# EAGLE design czuj_ruchu_naj (EAGLE 6.6.0)
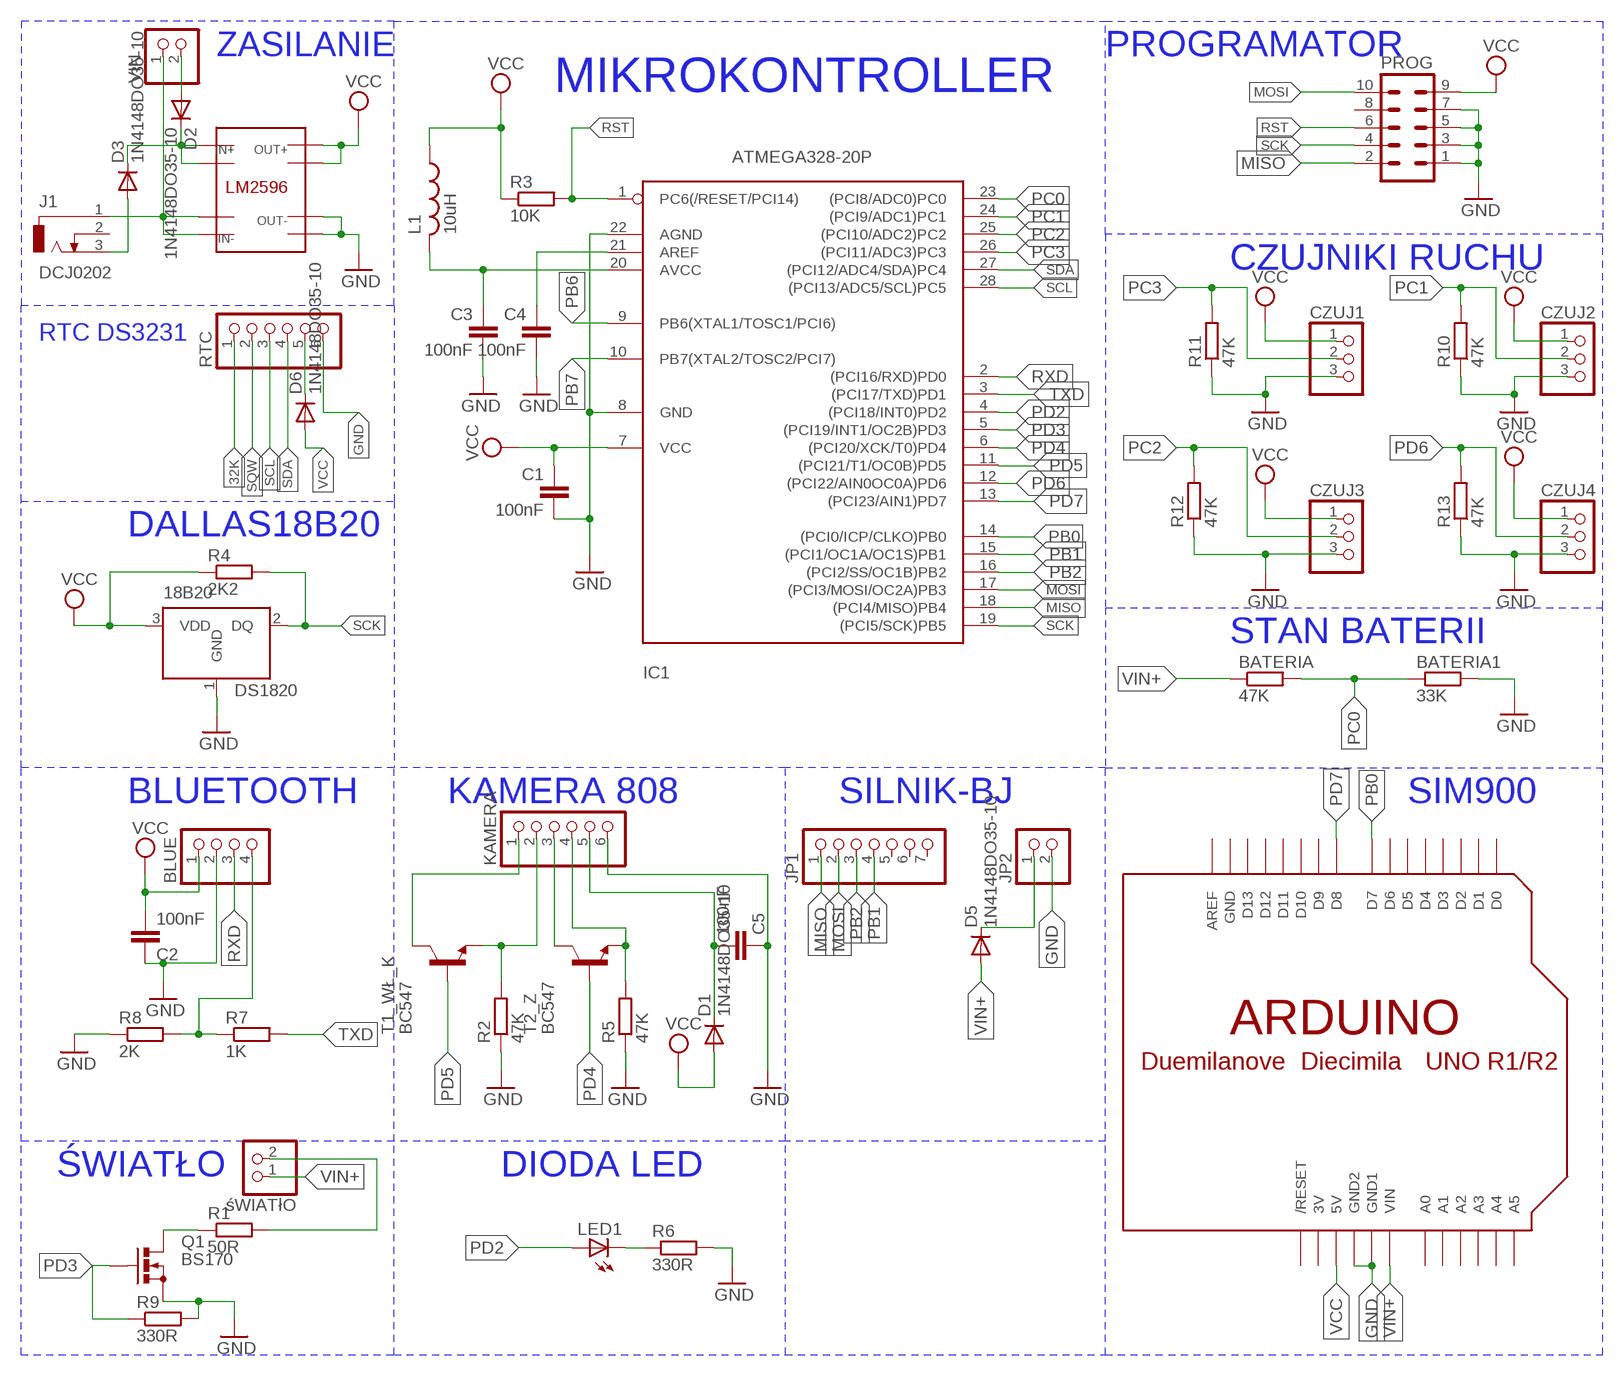
[diagram p0: schematic, sheet 1]

## Parts
18B20  DS1820  [TO-92]
BATERIA  47K  R-EU_0204/7  [0204/7]
BATERIA1  33K  R-EU_0204/7  [0204/7]
BLUE  PINHD-1X4  [1X04]
C1  100nF  C2,5-3  [C2.5-3]
C2  100nF  C2,5-3  [C2.5-3]
C3  100nF  C2,5-3  [C2.5-3]
C4  100nF  C2,5-3  [C2.5-3]
C5  100nF  C2,5-3  [C2.5-3]
CZUJ1  PINHD-1X3  [1X03]
CZUJ2  PINHD-1X3  [1X03]
CZUJ3  PINHD-1X3  [1X03]
CZUJ4  PINHD-1X3  [1X03]
D1  1N4148DO35-10  [DO35-10]
D2  1N4148DO35-10  [DO35-10]
D3  1N4148DO35-10  [DO35-10]
D5  1N4148DO35-10  [DO35-10]
D6  1N4148DO35-10  [DO35-10]
IC1  ATMEGA328-20P  [DIL28-3]
J1  DCJ0202  [DCJ0202]
JP1  PINHD-1X7/90  [1X07/90]
JP2  PINHD-1X2/90  [1X02/90]
KAMERA  PINHD-1X6/90  [1X06/90]
L1  10uH  L-US6000-XXX-RC  [6000-XXXX-RC]
LED1  LED5MM  [LED5MM]
PROG  MA05-2  [MA05-2]
Q1  BS170  [SOT54E]
R1  50R  R-EU_0204/7  [0204/7]
R2  47K  R-EU_0204/7  [0204/7]
R3  10K  R-EU_0204/7  [0204/7]
R4  2K2  R-EU_0204/7  [0204/7]
R5  47K  R-EU_0204/7  [0204/7]
R6  330R  R-EU_0204/7  [0204/7]
R7  1K  R-EU_0204/7  [0204/7]
R8  2K  R-EU_0204/7  [0204/7]
R9  330R  R-EU_0204/7  [0204/7]
R10  47K  R-EU_0204/7  [0204/7]
R11  47K  R-EU_0204/7  [0204/7]
R12  47K  R-EU_0204/7  [0204/7]
R13  47K  R-EU_0204/7  [0204/7]
RTC  PINHD-1X6/90  [1X06/90]
T1_WŁ_K  BC547  [TO92]
T2_Z  BC547  [TO92]
U$1  ARDUINO-NOHOLE  [ARDUINO-NOHOLE]
VIN  PINHD-1X2  [1X02]
ZASILANIE  LM2596  [LM25]
śWIATłO  PINHD-1X2  [1X02]

## Nets
32K: RTC.1
GND: 18B20.1(GND) BATERIA1.2 BLUE.2 C1.2 C2.1 C3.2 C4.2 C5.1 CZUJ1.3 CZUJ2.3 CZUJ3.3 CZUJ4.3 IC1.8(GND) IC1.22(AGND) JP2.2 KAMERA.6 PROG.1 PROG.3 PROG.5 PROG.7 Q1.S R2.1 R5.1 R6.2 R8.1 R9.2 R10.1 R11.1 R12.1 R13.1 RTC.6 U$1.GND1 U$1.GND2 ZASILANIE.OUT- ZASILANIE.OUT-.(OUT_)
MISO: IC1.18((PCI4/MISO)PB4) JP1.1 PROG.2
MOSI: IC1.17((PCI3/MOSI/OC2A)PB3) JP1.2 PROG.10
N$1: Q1.D R1.1
N$2: D2.A VIN.2
N$3: KAMERA.1 T1_WŁ_K.3(C)
N$4: R1.2 śWIATłO.2
N$5: C3.1 IC1.20(AVCC) L1.2
N$6: C4.1 IC1.21(AREF)
N$7: KAMERA.3 T2_Z.3(C)
N$8: C5.2 D1.C KAMERA.5
N$9: D3.A J1.3
N$10: LED1.K(C) R6.1
N$12: KAMERA.2 R2.2 T1_WŁ_K.1(E)
N$13: KAMERA.4 R5.2 T2_Z.1(E)
N$15: D6.C RTC.5
PB0: IC1.14((PCI0/ICP/CLKO)PB0) U$1.D7
PB1: IC1.15((PCI1/OC1A/OC1S)PB1) JP1.4
PB2: IC1.16((PCI2/SS/OC1B)PB2) JP1.3
PB6: IC1.9(PB6(XTAL1/TOSC1/PCI6))
PB7: IC1.10(PB7(XTAL2/TOSC2/PCI7))
PC0: BATERIA1.1 BATERIA.2 IC1.23((PCI8/ADC0)PC0)
PC1: CZUJ2.2 IC1.24((PCI9/ADC1)PC1) R10.2
PC2: CZUJ3.2 IC1.25((PCI10/ADC2)PC2) R12.2
PC3: CZUJ1.2 IC1.26((PCI11/ADC3)PC3) R11.2
PD2: IC1.4((PCI18/INT0)PD2) LED1.A
PD3: IC1.5((PCI19/INT1/OC2B)PD3) Q1.G R9.1
PD4: IC1.6((PCI20/XCK/T0)PD4) T2_Z.2(B)
PD5: IC1.11((PCI21/T1/OC0B)PD5) T1_WŁ_K.2(B)
PD6: CZUJ4.2 IC1.12((PCI22/AIN0OC0A)PD6) R13.2
PD7: IC1.13((PCI23/AIN1)PD7) U$1.D8
RST: IC1.1(PC6(/RESET/PCI14)) PROG.6 R3.2
RXD: BLUE.3 IC1.2((PCI16/RXD)PD0)
SCK: 18B20.2(DQ) IC1.19((PCI5/SCK)PB5) PROG.4 R4.2
SCL: IC1.28((PCI13/ADC5/SCL)PC5) RTC.3
SDA: IC1.27((PCI12/ADC4/SDA)PC4) RTC.4
SQW: RTC.2
TXD: IC1.3((PCI17/TXD)PD1) R7.2
TXDB: BLUE.4 R7.1 R8.2
VCC: 18B20.3(VDD) BLUE.1 C1.1 C2.2 CZUJ1.1 CZUJ2.1 CZUJ3.1 CZUJ4.1 D1.A D6.A IC1.7(VCC) L1.1 PROG.9 R3.1 R4.1 U$1.5V ZASILANIE.OUT+ ZASILANIE.OUT+.
VCCS1: D5.C JP2.1
VIN+: BATERIA.1 D2.C D3.C D5.A U$1.VIN ZASILANIE.IN+ ZASILANIE.IN+. śWIATłO.1
VIN-: J1.1 VIN.1 ZASILANIE.IN- ZASILANIE.IN-.
Unconnected: J1.2 JP1.5 JP1.6 JP1.7 PROG.8 U$1.A0 U$1.A1 U$1.A2 U$1.A3 U$1.A4 U$1.A5 U$1.AREF U$1.D0 U$1.D1 U$1.D2 U$1.D3 U$1.D4 U$1.D5 U$1.D6 U$1.D9 U$1.D10 U$1.D11 U$1.D12 U$1.D13 U$1.RESET(/RESET)

## Notes on the sheet
- ZASILANIE | PROGRAMATOR
- MIKROKONTROLLER
- CZUJNIKI RUCHU
- RTC DS3231
- DALLAS18B20
- STAN BATERII
- BLUETOOTH | KAMERA 808 | SILNIK-BJ | SIM900
- ŚWIATŁO | DIODA LED

## Power pins joined to a net without a drawn wire
3V: U$1.3V
GND: U$1.GND

## Library data of the parts
18B20 = DS1820:DS1820: DS1820 - 1-Wire Digital Thermometer
BATERIA BATERIA1 R1-R13 = resistor:R-EU_: RESISTOR, European symbol
BLUE = pinhead:PINHD-1X4: PIN HEADER
C1-C5 = capacitor-wima:C: CAPACITOR naming: grid - package width
CZUJ1-CZUJ4 = pinhead:PINHD-1X3: PIN HEADER
D1-D3 D5 D6 = diode:1N4148: DIODE high speed (Philips)
IC1 = atmega328:ATMEGA328*P: MICROCONTROLLER 32 kBytes FLASH 2 kBytes SRAM 1 kBytes EEPROM USART 8-channel 10 bit ADC
J1 = con-jack:DCJ0202: DC POWER JACK Source: DCJ0202.pdf; OC_FARNELL: unknown; OC_NEWARK: unknown
JP1 = pinhead:PINHD-1X7: PIN HEADER
JP2 VIN śWIATłO = pinhead:PINHD-1X2: PIN HEADER
KAMERA RTC = pinhead:PINHD-1X6: PIN HEADER
L1 = rcl:L-US: INDUCTOR, American symbol
LED1 = led:LED: LED OSRAM: - CHIPLED LG R971, LG N971, LY N971, LG Q971, LY Q971, LO R971, LY R971 LH N974, LH R974 LS Q976, LO Q976, LY Q976 LO Q996 - Hyper CHIPLED LW Q18S LB Q993, LB Q99A, LB R99A - SideLED LS A670, LO A670, LY A670, LG A670, LP A670 LB A673, LV A673, LT A673, LW A673 LH A674 LY A675 LS A676, LA A676, LO A676, LY A676, LW A676 LS A679, LY A679, LG A679 - Hyper Micro SIDELED® LS Y876, LA Y876, LO Y876, LY Y876 LT Y87S - SmartLED LW L88C, LW L88S LB L89C, LB L89S, LG L890 LS L89K, LO L89K, LY L89K LS L896, LA L896, LO L896, LY L896 - TOPLED LS T670, LO T670, LY T670, LG T670, LP T670 LSG T670, LSP T670, LSY T670, LOP T670, LYG T670 LG T671, LOG T671, LSG T671 LB T673, LV T673, LT T673, LW T673 LH T674 LS T676, LA T676, LO T676, LY T676, LB T676, LH T676, LSB T676, LW T676 LB T67C, LV T67C, LT T67C, LS T67K, LO T67K, LY T67K, LW E67C LS E67B, LA E67B, LO E67B, LY E67B, LB E67C, LV E67C, LT E67C LW T67C LS T679, LY T679, LG T679 LS T770, LO T770, LY T770, LG T770, LP T770 LB T773, LV T773, LT T773, LW T773 LH T774 LS E675, LA E675, LY E675, LS T675 LS T776, LA T776, LO T776, LY T776, LB T776 LHGB T686 LT T68C, LB T68C - Hyper Mini TOPLED® LB M676 - Mini TOPLED Santana® LG M470 LS M47K, LO M47K, LY M47K Source: http://www.osram.convergy.de LUXEON: - LUMILED® LXK2-PW12-R00, LXK2-PW12-S00, LXK2-PW14-U00, LXK2-PW14-V00 LXK2-PM12-R00, LXK2-PM12-S00, LXK2-PM14-U00 LXK2-PE12-Q00, LXK2-PE12-R00, LXK2-PE12-S00, LXK2-PE14-T00, LXK2-PE14-U00 LXK2-PB12-K00, LXK2-PB12-L00, LXK2-PB12-M00, LXK2-PB14-N00, LXK2-PB14-P00, LXK2-PB14-Q00 LXK2-PR12-L00, LXK2-PR12-M00, LXK2-PR14-Q00, LXK2-PR14-R00 LXK2-PD12-Q00, LXK2-PD12-R00, LXK2-PD12-S00 LXK2-PH12-R00, LXK2-PH12-S00 LXK2-PL12-P00, LXK2-PL12-Q00, LXK2-PL12-R00 Source: www.luxeon.com KINGBRIGHT: KA-3528ASYC Source: www.kingbright.com
PROG = con-lstb:MA05-2: PIN HEADER; OC_FARNELL: unknown; OC_NEWARK: unknown
Q1 = transistor-small-signal:BS170: N-CHANNEL MOS FET
T1_WŁ_K T2_Z = transistor:BC547: NPN TRANSISTOR
U$1 = adafruit:ARDUINO: Arduino Diecimila/Duemilanove Make a shield with ease, this package has all the named pins as well as the two mounting drill holes and an outline of the USB and DC power connector. The outline is on the DIMENSION layer, so if your board house uses it they will cut the outline to match. http://www.ladyada.net/library/pcb/eaglelibrary.html
ZASILANIE = lm2596s:LM2596

## Board
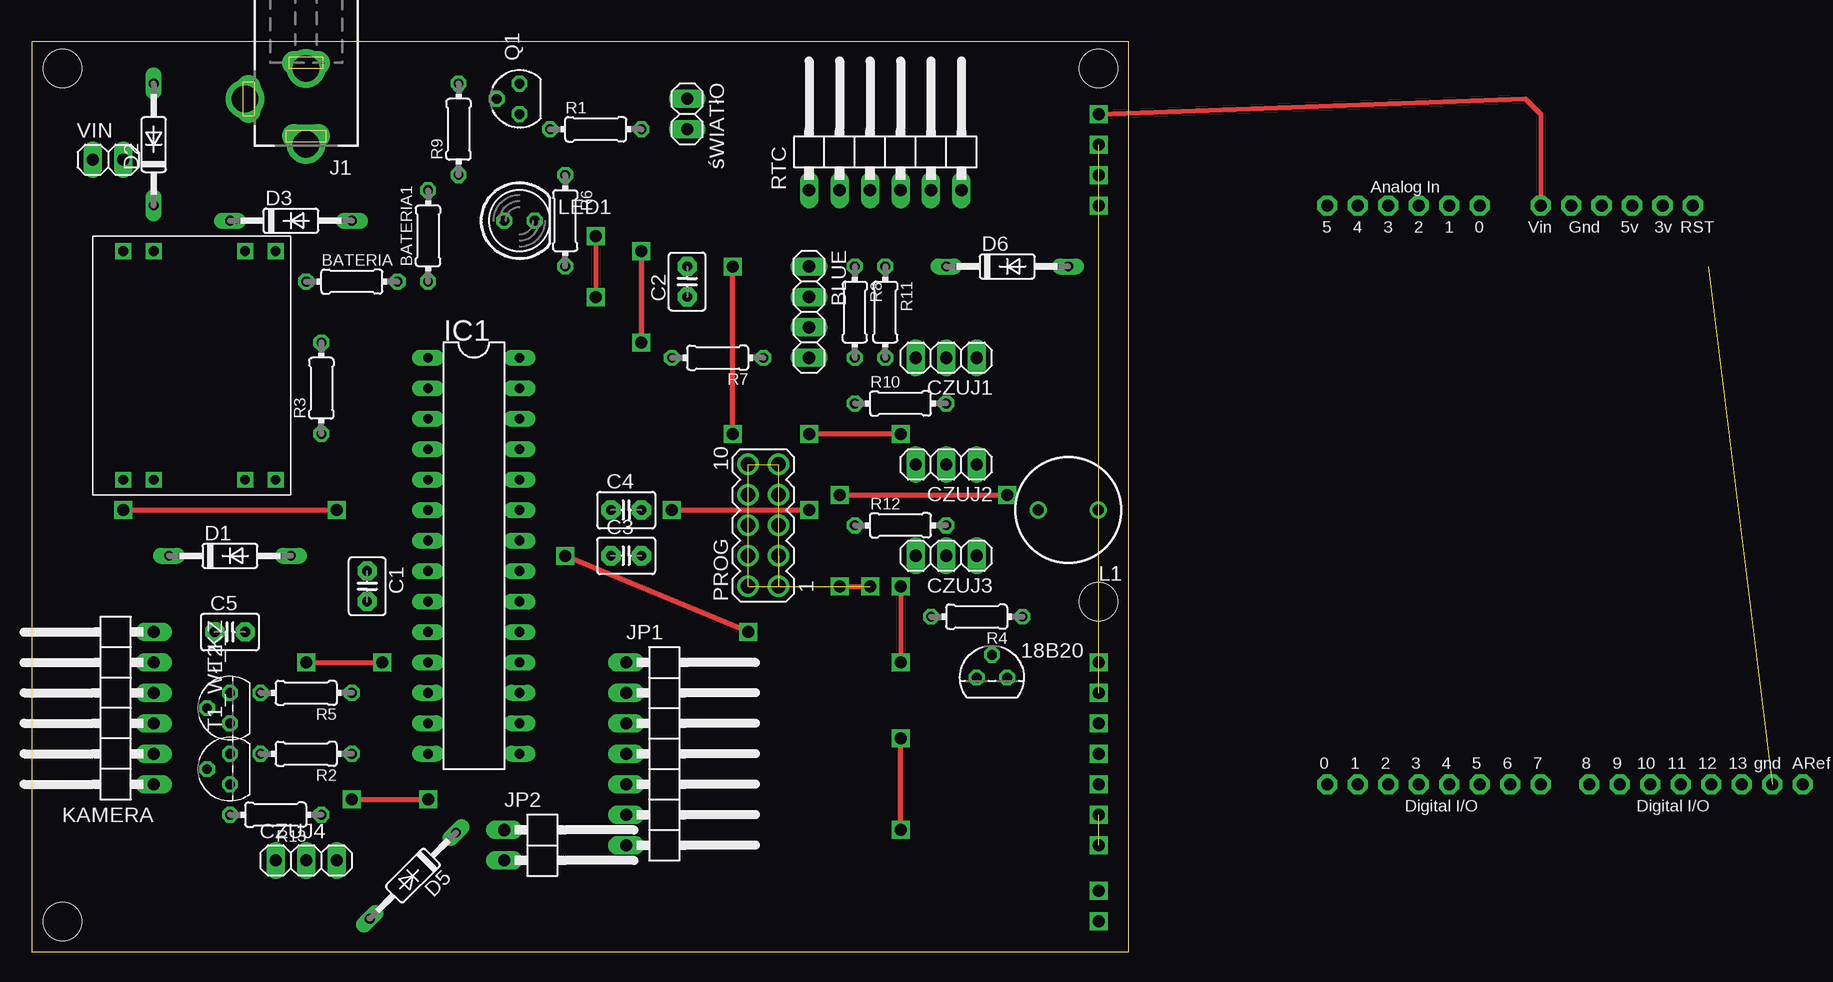
[diagram p1: board, top side]
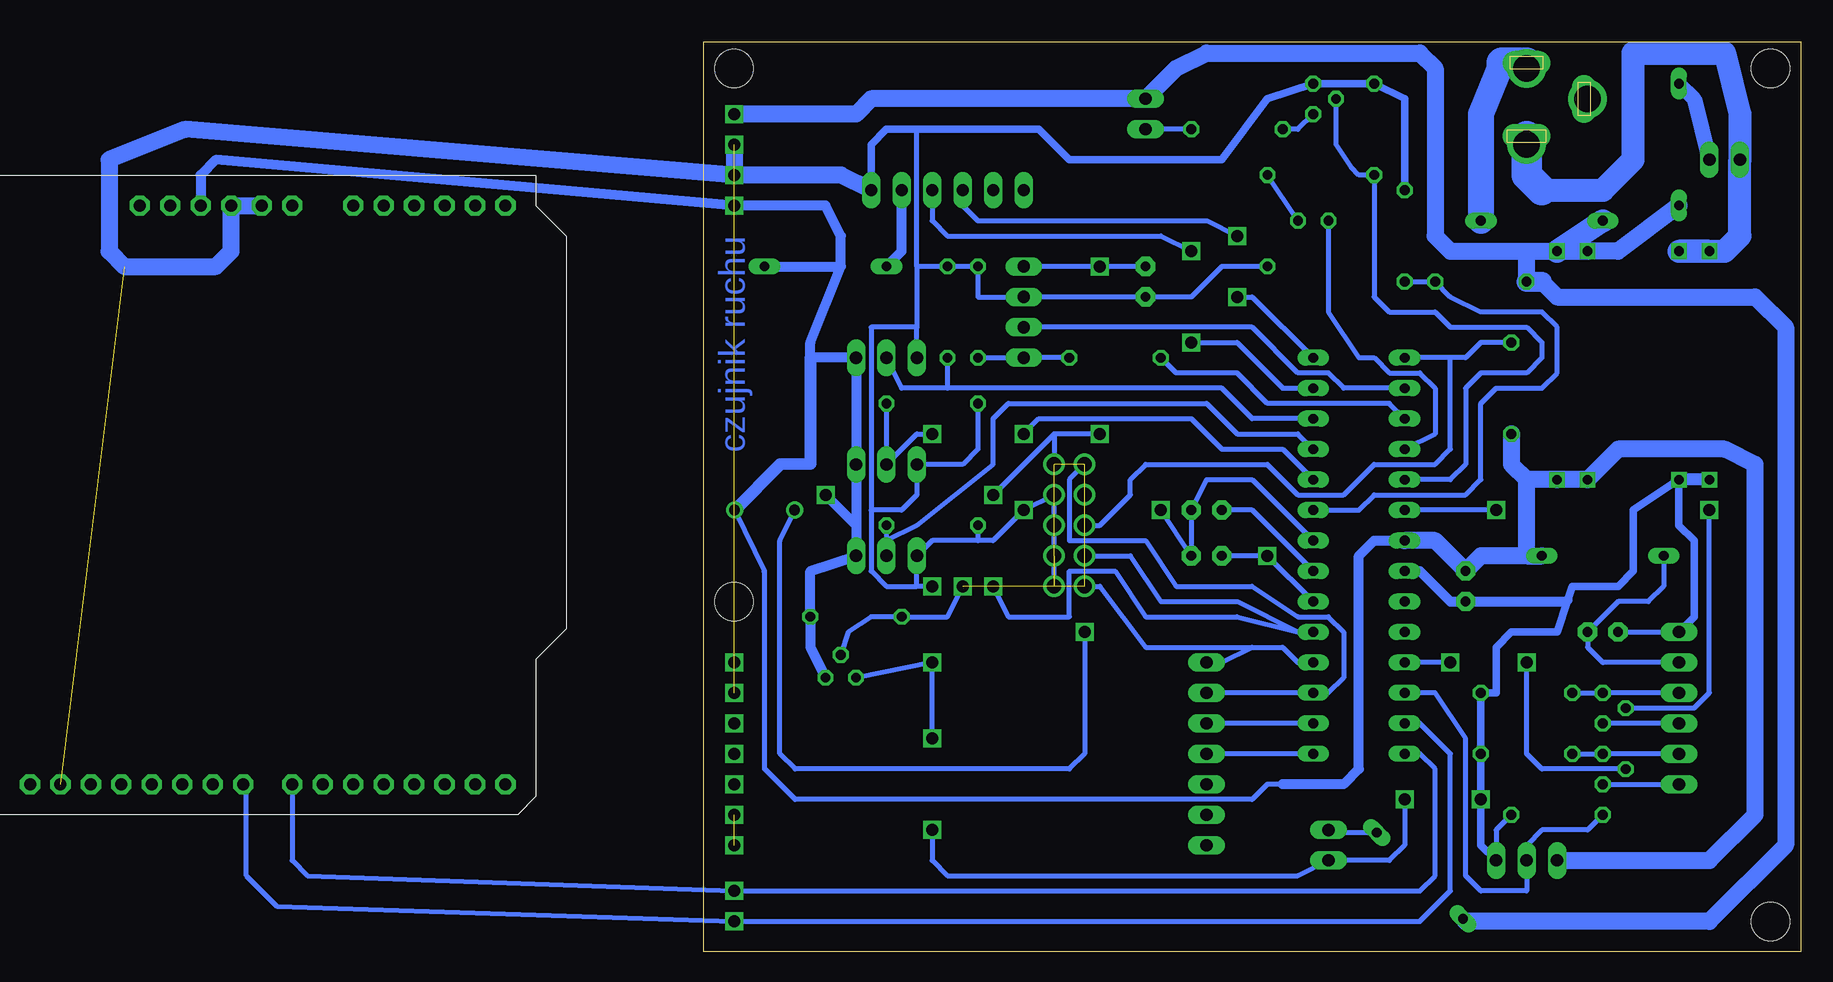
[diagram p2: board, bottom side, seen from below]

Size 91.42 x 75.87 mm. Coordinates in mm from the lower left corner, seen from the top.
Outline: 0,0 91.42,0 91.42,75.87 0,75.87 0,0
Copper layers (1*16): Top 0.035mm / dielectric 1.5mm / Bottom 0.035mm
Design rules "default": minimum track width 10mil, minimum drill 24mil, track to track 8mil, track to pad 8mil, pad to pad 8mil, via to via 8mil, smd to smd 8mil, copper to edge 40mil, drill to drill 8mil, minimum pad ring 10mil, minimum via ring 8mil, stop-mask expansion 4mil, vias tented up to drill 0mil, thermal gap 10mil
Holes 3.2 mm at 153.67,72.39 152.4,7.62 2.54,73.66 2.54,2.54 88.9,73.66 88.9,29.21

### Footprints (pad centres in the part's own frame; a part is rotated, then mirrored left to right if it is on the bottom)
TO-92 = drill 0.813 pad 1.27 octagon: 1 -1.27,0; 2 0,1.905; 3 1.27,0
0204/7 = drill 0.813 octagon: 1 -3.81,0; 2 3.81,0
1X04 = drill 1.016 long: 1 -3.81,0; 2 -1.27,0; 3 1.27,0; 4 3.81,0
C2.5-3 = drill 0.813 pad 1.6 octagon: 1 -1.27,0; 2 1.27,0
1X03 = drill 1.016 long: 1 -2.54,0; 2 0,0; 3 2.54,0
DO35-10 = drill 0.813 long: A 5.08,0; C -5.08,0
DIL28-3 = drill 0.813 long: 1 -16.51,-3.81; 2 -13.97,-3.81; 3 -11.43,-3.81; 4 -8.89,-3.81; 5 -6.35,-3.81; 6 -3.81,-3.81; 7 -1.27,-3.81; 8 1.27,-3.81; 9 3.81,-3.81; 10 6.35,-3.81; 11 8.89,-3.81; 12 11.43,-3.81; 13 13.97,-3.81; 14 16.51,-3.81; 15 16.51,3.81; 16 13.97,3.81; 17 11.43,3.81; 18 8.89,3.81; 19 6.35,3.81; 20 3.81,3.81; 21 1.27,3.81; 22 -1.27,3.81; 23 -3.81,3.81; 24 -6.35,3.81; 25 -8.89,3.81; 26 -11.43,3.81; 27 -13.97,3.81; 28 -16.51,3.81
DCJ0202 = drill 1 pad 2 long: 1 0,3.1; 2 4.8,0; 3 0,-3
1X07/90 = drill 1.016 long: 1 -7.62,-3.81; 2 -5.08,-3.81; 3 -2.54,-3.81; 4 0,-3.81; 5 2.54,-3.81; 6 5.08,-3.81; 7 7.62,-3.81
1X02/90 = drill 1.016 long: 1 -1.27,-3.81; 2 1.27,-3.81
1X06/90 = drill 1.016 long: 1 -6.35,-3.81; 2 -3.81,-3.81; 3 -1.27,-3.81; 4 1.27,-3.81; 5 3.81,-3.81; 6 6.35,-3.81
6000-XXXX-RC = drill 0.9 pad 1.422: 1 -2.5,0; 2 2.5,0
LED5MM = drill 0.813 octagon: A -1.27,0; K 1.27,0
MA05-2 = drill 1.016 octagon: 1 -5.08,-1.27; 2 -5.08,1.27; 3 -2.54,-1.27; 4 -2.54,1.27; 5 0,-1.27; 6 0,1.27; 7 2.54,-1.27; 8 2.54,1.27; 9 5.08,-1.27; 10 5.08,1.27
SOT54E = drill 0.813 octagon: D -1.27,0; G 0,1.905; S 1.27,0
TO92 = drill 0.813 octagon: 1 1.27,0; 2 0,1.905; 3 -1.27,0
ARDUINO-NOHOLE = drill 1 pad 1.676 octagon: 3V 35.56,2.54; 5V 38.1,2.54; A0 50.8,2.54; A1 53.34,2.54; A2 55.88,2.54; A3 58.42,2.54; A4 60.96,2.54; A5 63.5,2.54; AREF 23.876,50.8; D0 63.5,50.8; D1 60.96,50.8; D2 58.42,50.8; D3 55.88,50.8; D4 53.34,50.8; D5 50.8,50.8; D6 48.26,50.8; D7 45.72,50.8; D8 41.656,50.8; D9 39.116,50.8; D10 36.576,50.8; D11 34.036,50.8; D12 31.496,50.8; D13 28.956,50.8; GND 26.416,50.8; GND1 43.18,2.54; GND2 40.64,2.54; RESET 33.02,2.54; VIN 45.72,2.54
1X02 = drill 1.016 long: 1 -1.27,0; 2 1.27,0
LM25 = drill 0.8 square: IN+ 0,2.54; IN+. 0,0; IN- 0,12.7; IN-. 0,10.16; OUT+ -19.05,2.54; OUT+. -19.05,0; OUT- -19.05,12.7; OUT-. -19.05,10.16

### Placement (x,y rotation side)
18B20  80.01,22.86 0 top
BATERIA  26.67,55.88 0 top
BATERIA1  33.02,59.69 90 top
BLUE  64.77,53.34 270 top
C1  27.94,30.48 270 top
C2  54.61,55.88 90 top
C3  49.53,33.02 0 top
C4  49.53,36.83 0 top
C5  16.51,26.67 0 top
CZUJ1  76.2,49.53 180 top
CZUJ2  76.2,40.64 180 top
CZUJ3  76.2,33.02 180 top
CZUJ4  22.86,7.62 0 top
D1  16.51,33.02 0 top
D2  10.16,67.31 90 top
D3  21.59,60.96 0 top
D5  31.75,6.35 225 top
D6  81.28,57.15 0 top
IC1  36.83,33.02 270 top
J1  22.86,71.12 180 top
JP1  53.34,16.51 270 top
JP2  43.18,8.89 270 top
KAMERA  6.35,20.32 90 top
L1  86.36,36.83 180 top
LED1  40.64,60.96 0 top
PROG  60.96,35.56 90 top
Q1  40.64,71.12 90 top
R1  46.99,68.58 0 top
R2  22.86,16.51 180 top
R3  24.13,46.99 90 top
R4  78.74,27.94 180 top
R5  22.86,21.59 180 top
R6  44.45,60.96 270 top
R7  57.15,49.53 180 top
R8  68.58,53.34 270 top
R9  35.56,68.58 90 top
R10  72.39,45.72 0 top
R11  71.12,53.34 270 top
R12  72.39,35.56 0 top
R13  20.32,11.43 180 top
RTC  71.12,67.31 0 top
T1_WŁ_K  16.51,15.24 90 top
T2_Z  16.51,20.32 90 top
U$1  171.45,64.77 180 top  (outside the outline)
VIN  6.35,66.04 0 top
ZASILANIE  20.32,58.42 90 top
śWIATłO  54.61,69.85 270 top

### Tracks (layer width: path | path; a pad name or v marks a point on that pad's centre or on a via)
GND  (via drill 1)  (3 unrouted)
  Top 0.406: v26.67,12.7 v33.02,12.7 | v72.39,10.16 v72.39,17.78 | v53.34,36.83 v64.77,36.83 | v72.39,30.48 v72.39,24.13
  Bottom 0.406: PROG.1 PROG.7 v64.77,36.83 67.31,34.29 68.58,34.29 | IC1.22 45.72,39.37 49.53,39.37 C4.2 C3.2 v53.34,36.83 | v33.02,12.7 33.02,8.89 34.29,7.62 JP2.2 41.91,6.35 71.12,6.35 72.39,7.62 v72.39,10.16 | 73.66,57.15 73.66,68.58 | 73.66,57.15 R11.1 R8.1 68.58,54.61 BLUE.2 C2.1 50.8,54.61 48.26,57.15 R6.2 | 73.66,57.15 73.66,52.07 | CZUJ1.3 73.66,52.07 | 73.66,52.07 77.47,52.07 77.47,36.83 | 77.47,36.83 77.47,31.75 76.2,30.48 73.66,30.48 | v72.39,30.48 73.66,30.48 | 73.66,30.48 CZUJ3.3 72.39,34.29 68.58,34.29 | 77.47,36.83 74.93,36.83 73.66,38.1 CZUJ2.3 69.85,40.64 68.58,41.91 R10.1 | v72.39,17.78 v72.39,24.13 18B20.1 | C5.1 KAMERA.6 | R13.1 25.4,10.16 CZUJ4.3 | R12.1 68.58,34.29
  Bottom 0.61: 8.89,39.37 ZASILANIE.OUT-. | ZASILANIE.OUT-. 10.16,35.56 8.89,34.29 8.89,27.94 KAMERA.6 | RTC.6 77.47,67.31 76.2,68.58 73.66,68.58 63.5,68.58 60.96,66.04 48.26,66.04 44.45,71.12 Q1.S R9.2 33.02,71.12 BATERIA1.2 | ZASILANIE.OUT-. 13.97,36.83 13.97,31.75 15.24,30.48 19.05,30.48 19.43,29.34 20.32,26.67 24.13,26.67 25.4,25.4 25.4,21.59 R5.1 R2.1 v26.67,12.7 26.67,8.89 CZUJ4.3 | C1.2 29.21,29.21
  Bottom 0.813: 19.43,29.34 19.56,29.21 29.21,29.21 31.75,31.75 IC1.8
  Bottom 1.016: ZASILANIE.OUT- ZASILANIE.OUT-.
  Bottom 1.422: U$1.GND1 U$1.GND2 130.81,58.42 132.08,57.15 139.7,57.15 140.97,58.42 140.97,66.04 134.62,68.58 v88.9,64.77 | RTC.6 80.01,64.77 v88.9,64.77 | 88.9,67.31 v88.9,64.77
MISO  (1 unrouted)
  Top 0.406: 67.31,30.48 69.85,30.48
  Bottom 0.406: PROG.2 58.42,30.48 54.61,25.4 45.72,25.4 | 45.72,25.4 43.18,25.4 41.91,24.13 IC1.18 | 45.72,25.4 48.26,24.13 JP1.1
MOSI
  Bottom 0.406: PROG.10 60.96,39.37 60.96,34.29 54.61,34.29 52.07,30.48 45.72,30.48 41.91,27.94 39.37,27.94 38.1,26.67 38.1,22.86 39.37,21.59 IC1.17 JP1.2
N$1
  Bottom 0.406: Q1.D 41.91,68.58 R1.1
N$2
  Bottom 1.27: D2.A 8.89,71.12 VIN.2
N$3
  Bottom 0.406: T1_WŁ_K.3 KAMERA.1
N$4
  Bottom 0.406: R1.2 śWIATłO.2
N$5  (via drill 1)
  Top 0.406: v59.69,26.67 v44.45,33.02
  Bottom 0.406: IC1.20 v44.45,33.02 C3.1 | v59.69,26.67 59.69,16.51 60.96,15.24 83.82,15.24 85.09,16.51 85.09,34.29 L1.2
N$6
  Bottom 0.406: IC1.21 45.72,36.83 C4.1
N$7
  Bottom 0.406: KAMERA.3 T2_Z.3
N$8
  Bottom 0.406: KAMERA.5 16.51,24.13 17.78,25.4 C5.2 15.24,29.21 12.7,29.21 11.43,30.48 D1.C
N$9
  Bottom 2.184: 24.94,74.12 26.67,69.85 D3.A
  Bottom 2.54: J1.3 24.94,74.12
N$10
  Bottom 0.406: LED1.K R6.1
N$11  (via drill 1)  (1 unrouted)
  other vias: 67.31,30.48 69.85,30.48
N$12
  Bottom 0.406: R2.2 T1_WŁ_K.1 KAMERA.2
N$13
  Bottom 0.406: R5.2 T2_Z.1 KAMERA.4
N$14  (via drill 1)  (2 unrouted)
  other vias: 88.9,21.59 88.9,24.13 88.9,67.31
N$15
  Bottom 0.813: D6.C 74.93,58.42 RTC.5
N$16  (via drill 1)
  other vias: 88.9,19.05
N$17  (via drill 1)
  other vias: 88.9,16.51
N$18  (via drill 1)
  other vias: 88.9,13.97
N$19  (via drill 1)  (1 unrouted)
  other vias: 88.9,11.43 88.9,8.89
N$20  (via drill 2.2)
  other vias: 17.78,71.12
N$21  (via drill 2.2)
  other vias: 22.86,73.66
N$22  (via drill 2.2)
  other vias: 22.86,67.31
N$23  (via drill 1.2)  (9 unrouted)
  other vias: 59.69,40.64 62.23,40.64 59.69,38.1 62.23,38.1 59.69,35.56 62.23,35.56 59.69,33.02 62.23,33.02 59.69,30.48 62.23,30.48
PB0  (via drill 1)
  Bottom 0.406: U$1.D7 125.73,7.62 124.46,6.35 v88.9,5.08 31.75,5.08 30.48,6.35 30.48,15.24 31.75,16.51 IC1.14
PB1
  Bottom 0.406: IC1.15 JP1.4
PB2
  Bottom 0.406: IC1.16 JP1.3
PC0
  Bottom 0.406: IC1.23 36.83,36.83 35.56,38.1 27.94,38.1 26.67,39.37 26.67,45.72 25.4,46.99 21.59,46.99 20.32,48.26 20.32,52.07 21.59,53.34 26.67,53.34 29.21,54.61 BATERIA.2 BATERIA1.1
PC1  (via drill 1)
  Top 0.406: v72.39,43.18 v64.77,43.18
  Bottom 0.406: v72.39,43.18 73.66,43.18 CZUJ2.2 R10.2 | v64.77,43.18 63.5,44.45 50.8,44.45 48.26,41.91 43.18,41.91 IC1.24
PC2
  Bottom 0.406: CZUJ3.2 76.2,34.29 | 76.2,34.29 73.66,35.56 67.31,40.64 67.31,44.45 66.04,45.72 49.53,45.72 46.99,43.18 41.91,43.18 IC1.25 | R12.2 76.2,34.29
PC3
  Bottom 0.406: IC1.26 45.72,44.45 48.26,46.99 71.12,46.99 | 71.12,46.99 74.93,46.99 CZUJ1.2 | R11.2 71.12,46.99
PD2
  Bottom 0.406: LED1.A 39.37,53.34 36.83,49.53 35.56,49.53 34.29,48.26 31.75,48.26 30.48,46.99 30.48,43.18 IC1.4
PD3
  Bottom 0.406: Q1.G 38.73,67.31 37.47,65.41 36.83,64.77 R9.1 35.56,54.61 34.29,53.34 30.48,53.34 29.21,52.07 22.86,52.07 21.59,50.8 21.59,49.53 22.86,48.26 26.67,48.26 27.94,46.99 27.94,40.64 29.21,39.37 IC1.5
PD4  (via drill 1)
  Top 0.406: v7.62,36.83 v25.4,36.83
  Bottom 0.406: T2_Z.2 8.89,20.32 7.62,21.59 v7.62,36.83 | v25.4,36.83 IC1.6
PD5  (via drill 1)
  Top 0.406: v22.86,24.13 v29.21,24.13
  Bottom 0.406: T1_WŁ_K.2 21.59,15.24 22.86,16.51 v22.86,24.13 | v29.21,24.13 IC1.11
PD6
  Bottom 0.406: IC1.12 30.48,21.59 27.94,17.78 27.94,6.35 26.67,5.08 22.86,5.08 CZUJ4.2 22.86,8.89 21.59,10.16 17.78,10.16 R13.2
PD7  (via drill 1)
  Bottom 0.406: IC1.13 31.75,19.05 29.21,16.51 29.21,5.08 31.75,2.54 v88.9,2.54 127,3.81 129.54,6.35 129.54,13.72 U$1.D8
RST
  Bottom 0.406: R3.2 26.67,50.8 27.94,49.53 29.21,49.53 | 29.21,49.53 IC1.1 | PROG.6 58.42,35.56 55.88,38.1 55.88,39.37 54.61,40.64 44.45,40.64 41.91,38.1 38.1,38.1 35.56,40.64 30.48,40.64 29.21,41.91 29.21,49.53
RXD
  Bottom 0.406: IC1.2 38.1,46.99 39.37,48.26 41.91,48.26 45.72,52.07 BLUE.3
SCK  (1 unrouted)
  Bottom 0.406: PROG.4 55.88,33.02 53.34,29.21 46.99,29.21 41.91,26.67 | 41.91,26.67 IC1.19 | 41.91,26.67 46.99,27.94 54.61,27.94 57.15,31.75 60.96,31.75 60.96,27.94 66.04,27.94 67.31,30.48 | 18B20.2 79.38,26.67 77.47,27.94 R4.2 71.12,27.94 69.85,30.48
SCL  (via drill 1)
  Top 0.406: v46.99,59.69 v46.99,54.61
  Bottom 0.406: RTC.3 69.85,62.23 68.58,60.96 49.53,60.96 v46.99,59.69 | v46.99,54.61 45.72,54.61 IC1.28
SDA  (via drill 1)
  Top 0.406: v50.8,58.42 v50.8,50.8
  Bottom 0.406: RTC.4 72.39,60.96 71.12,59.69 53.34,59.69 v50.8,58.42 | v50.8,50.8 46.99,50.8 43.18,46.99 IC1.27
TXD
  Bottom 0.406: IC1.3 34.29,45.72 44.45,45.72 46.99,48.26 52.07,48.26 R7.2
TXDB
  Bottom 0.406: R8.2 BLUE.4 R7.1
VCC  (via drill 1)
  Top 0.406: v67.31,38.1 v81.28,38.1 | v58.42,43.18 v58.42,57.15
  Bottom 0.406: 62.23,43.18 PROG.9 | 62.23,43.18 v67.31,38.1 | C2.2 v58.42,57.15 BLUE.1 | 43.18,13.97 44.45,13.97 45.72,12.7 83.82,12.7 86.36,15.24 86.36,31.71 | 86.36,31.71 86.36,31.75 86.4,31.71 86.36,31.71 | 86.36,31.71 L1.1 | v58.42,43.18 62.23,43.18
  Bottom 0.813: IC1.7 35.56,34.29 36.83,33.02 36.83,15.24 38.1,13.97 43.18,13.97 | U$1.5V 133.35,64.77 132.08,66.04 v88.9,62.23 81.28,62.23 80.01,59.69 80.01,57.15 | 80.01,57.15 82.55,50.8 82.55,49.53 CZUJ1.1 CZUJ2.1 78.74,35.56 | 78.74,35.56 CZUJ3.1 82.55,31.75 R4.1 82.55,25.4 18B20.3 | v81.28,38.1 78.74,35.56 | D6.A 80.01,57.15
  Bottom 1.016: 82.55,49.53 82.55,40.68 85.09,40.64 L1.1
  Bottom 1.422: 22.86,33.02 22.86,39.37 | 22.86,39.37 ZASILANIE.OUT+. ZASILANIE.OUT+ 15.24,41.91 6.35,41.91 3.81,40.64 3.81,11.43 7.62,7.62 CZUJ4.1 | 22.86,33.02 D1.A | 22.86,33.02 26.67,33.02 C1.1 30.48,34.29 IC1.7 | R3.1 24.13,40.64 22.86,39.37
VCCS1
  Bottom 0.406: D5.C 40.64,9.94 JP2.1
VIN+  (via drill 1)
  Top 0.406: v88.9,69.85 124.46,71.12 125.73,69.85 U$1.VIN
  Bottom 0.406: D5.A 25.4,2.76 27.94,2.54
  Bottom 1.422: 22.86,58.42 29.21,58.42 30.48,59.69 30.48,73.66 31.75,74.93 49.53,74.93 52.07,73.66 śWIATłO.1 77.47,71.12 78.74,69.85 v88.9,69.85 | 22.86,58.42 ZASILANIE.IN+. ZASILANIE.IN+ 15.24,58.42 D2.C | BATERIA.1 22.86,58.42 | 21.59,55.88 20.32,54.61 3.81,54.61 1.27,52.07 1.27,8.89 7.62,2.54 27.94,2.54
  Bottom 1.676: BATERIA.1 21.59,55.88
  Bottom 1.93: D3.C ZASILANIE.IN+.
VIN-
  Bottom 1.93: ZASILANIE.IN- ZASILANIE.IN-. 6.35,58.42 5.08,59.69 VIN.1 5.08,69.85 6.35,74.93 13.97,74.93 13.97,66.04 16.51,63.5 21.59,63.5
  Bottom 2.54: 21.59,63.5 22.86,64.77 J1.1

### Text on the board
Bottom: czujnik ruchu